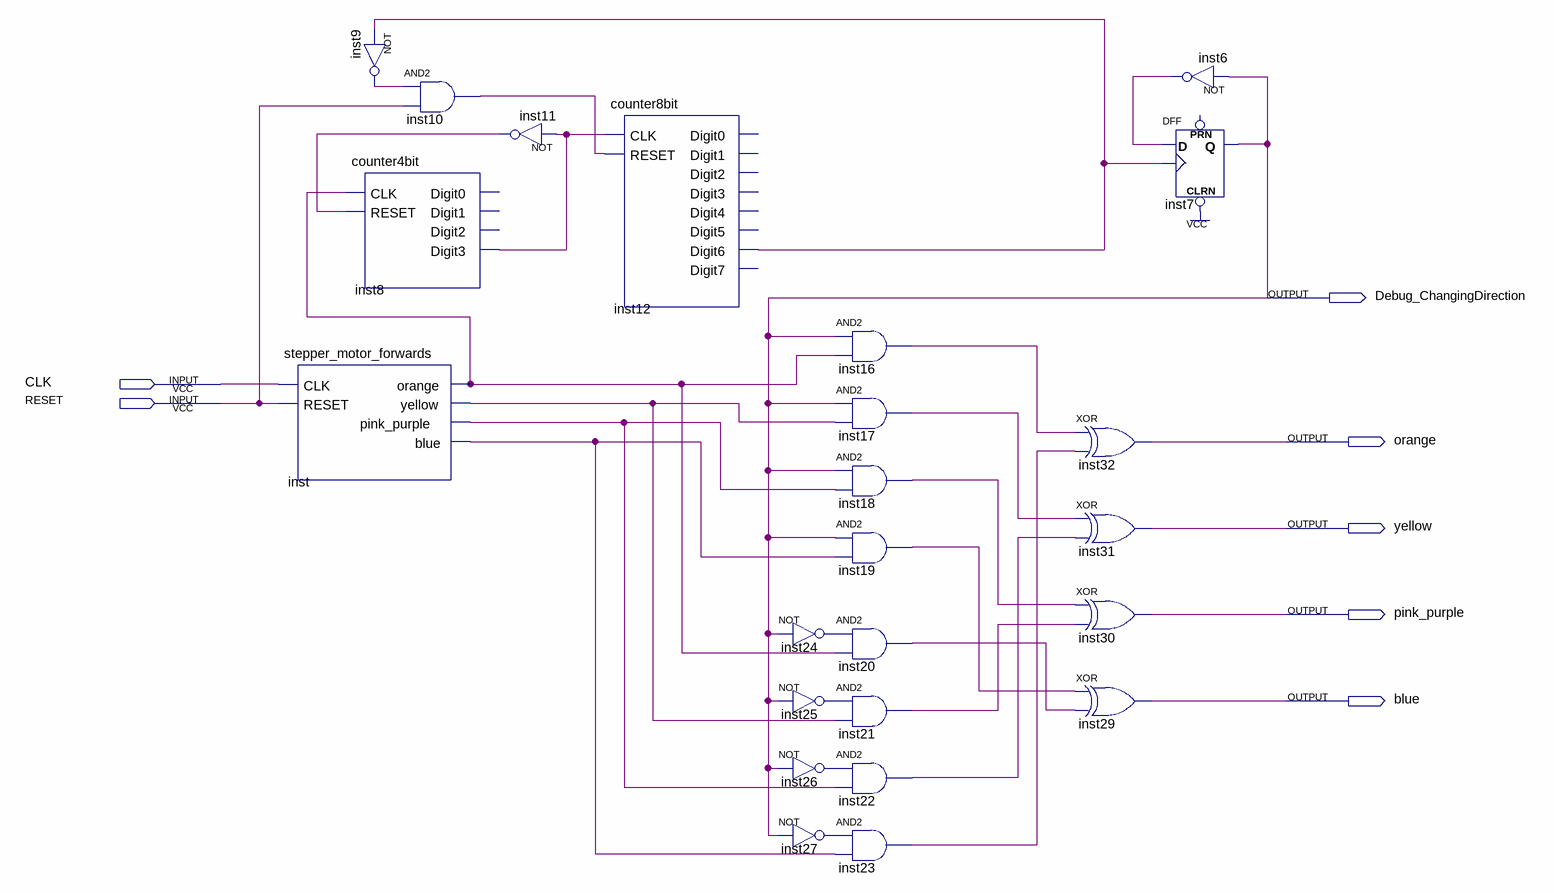
[diagram p0: schematic sheet]
// Quartus schematic stepper_motor_controller.bdf as structural Verilog: 24 symbols, 7 pins
module stepper_motor_controller (
  input  CLK,
  input  RESET,
  output Debug_ChangingDirection,
  output orange,
  output yellow,
  output pink_purple,
  output blue
);

  wire inst6_out, inst8_digit3, inst9_out, inst10_out, inst11_out, inst12_digit6, inst16_out, inst17_out,
       inst18_out, inst19_out, inst20_out, inst21_out, inst22_out, inst23_out, inst24_out, inst25_out,
       inst26_out, inst27_out, inst_blue, inst_orange, inst_pink_purple, inst_yellow;

  stepper_motor_forwards inst (
    .CLK(CLK), .RESET(RESET), .orange(inst_orange), .yellow(inst_yellow), .pink_purple(inst_pink_purple),
    .blue(inst_blue));
  not inst9 (inst9_out, inst12_digit6);
  counter4bit inst8 (.CLK(inst_orange), .RESET(inst11_out), .Digit3(inst8_digit3));  // open: Digit0, Digit1, Digit2
  and inst10 (inst10_out, inst9_out, RESET);
  not inst11 (inst11_out, inst8_digit3);
  counter8bit inst12 (
    .CLK(inst8_digit3), .RESET(inst10_out), .Digit6(inst12_digit6));  // open: Digit0, Digit1, Digit2, Digit3, Digit4, Digit5, Digit7
  and inst16 (inst16_out, Debug_ChangingDirection, inst_orange);
  and inst17 (inst17_out, Debug_ChangingDirection, inst_yellow);
  and inst18 (inst18_out, Debug_ChangingDirection, inst_pink_purple);
  and inst19 (inst19_out, Debug_ChangingDirection, inst_blue);
  and inst20 (inst20_out, inst24_out, inst_orange);
  not inst24 (inst24_out, Debug_ChangingDirection);
  and inst21 (inst21_out, inst25_out, inst_yellow);
  not inst25 (inst25_out, Debug_ChangingDirection);
  and inst22 (inst22_out, inst26_out, inst_pink_purple);
  not inst26 (inst26_out, Debug_ChangingDirection);
  and inst23 (inst23_out, inst27_out, inst_blue);
  not inst27 (inst27_out, Debug_ChangingDirection);
  xor inst32 (orange, inst16_out, inst23_out);
  xor inst31 (yellow, inst17_out, inst22_out);
  xor inst30 (pink_purple, inst18_out, inst21_out);
  xor inst29 (blue, inst19_out, inst20_out);
  not inst6 (inst6_out, Debug_ChangingDirection);
  DFF inst7 (.CLRN(1'b1), .CLK(inst12_digit6), .D(inst6_out), .Q(Debug_ChangingDirection));  // open: PRN
endmodule
